# EAGLE schematic Downey (EAGLE 6.6.0)
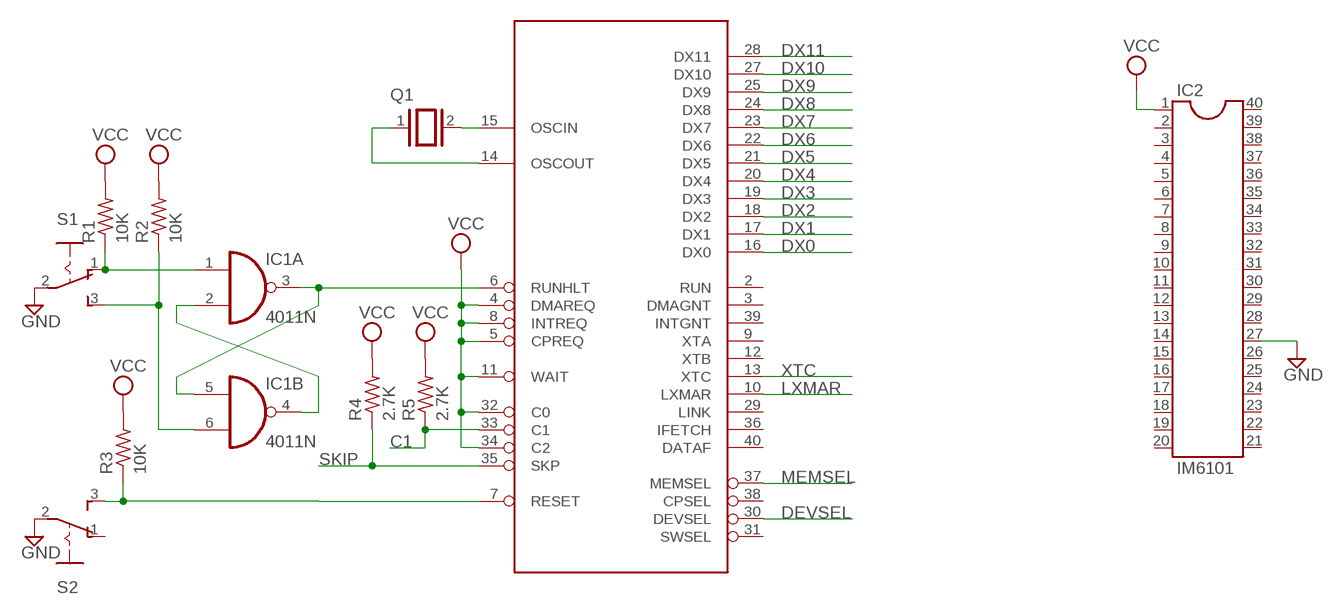
[diagram p0: schematic, sheet 1]

## Parts
IC1  4011N  [DIL14]
IC2  IM6101  DIL40  [DIL40]
Q1  XTAL/S  [QS]
R1  10K  R-US_0207/10  [0207/10]
R2  10K  R-US_0207/10  [0207/10]
R3  10K  R-US_0207/10  [0207/10]
R4  2.7K  R-US_0207/10  [0207/10]
R5  2.7K  R-US_0207/10  [0207/10]
S1  255SB  [255SB]
S2  255SB  [255SB]
U$1  IM6100  [DIL40]

## Nets
C1: R5.1 U$1.33(C1)
DEVSEL: U$1.30(DEVSEL)
DX0: U$1.16(DX0)
DX1: U$1.17(DX1)
DX2: U$1.18(DX2)
DX3: U$1.19(DX3)
DX4: U$1.20(DX4)
DX5: U$1.21(DX5)
DX6: U$1.22(DX6)
DX7: U$1.23(DX7)
DX8: U$1.24(DX8)
DX9: U$1.25(DX9)
DX10: U$1.27(DX10)
DX11: U$1.28(DX11)
GND: IC2.27 S1.2(P) S2.2(P)
LXMAR: U$1.10(LXMAR)
MEMSEL: U$1.37(MEMSEL)
N$1: Q1.1 U$1.14(OSCOUT)
N$2: R3.1 S2.3(S) U$1.7(RESET)
N$3: IC1.3(A:O) IC1.5(B:I0) U$1.6(RUNHLT)
N$4: IC1.2(A:I1) IC1.4(B:O)
N$5: Q1.2 U$1.15(OSCIN)
N$6: IC1.6(B:I1) R2.1 S1.3(S)
N$7: IC1.1(A:I0) R1.1 S1.1(O)
SKIP: R4.1 U$1.35(SKP)
VCC: IC2.1 R1.2 R2.2 R3.2 R4.2 R5.2 U$1.4(DMAREQ) U$1.5(CPREQ) U$1.8(INTREQ) U$1.11(WAIT) U$1.32(C0) U$1.34(C2)
XTC: U$1.13(XTC)
Unconnected: IC1.8(C:I0) IC1.9(C:I1) IC1.10(C:O) IC1.11(D:O) IC1.12(D:I0) IC1.13(D:I1) IC2.2 IC2.3 IC2.4 IC2.5 IC2.6 IC2.7 IC2.8 IC2.9 IC2.10 IC2.11 IC2.12 IC2.13 IC2.14 IC2.15 IC2.16 IC2.17 IC2.18 IC2.19 IC2.20 IC2.21 IC2.22 IC2.23 IC2.24 IC2.25 IC2.26 IC2.28 IC2.29 IC2.30 IC2.31 IC2.32 IC2.33 IC2.34 IC2.35 IC2.36 IC2.37 IC2.38 IC2.39 IC2.40 S2.1(O) U$1.2(RUN) U$1.3(DMAGNT) U$1.9(XTA) U$1.12(XTB) U$1.29(LINK) U$1.31(SWSEL) U$1.36(IFETCH) U$1.38(CPSEL) U$1.39(INTGNT) U$1.40(DATAF)

## Power pins joined to a net without a drawn wire
GND: U$1.26(GND)
VCC: U$1.1(VCC)
VDD: IC1.14(P:VDD)
VSS: IC1.7(P:VSS)

## Library data of the parts
IC1 = 40xx:4011: Quad 2-input NAND
IC2 = ic-package:DIL40: Dual In Line
Q1 = special:XTAL/S: CRYSTAL
R1-R5 = rcl:R-US_: RESISTOR, American symbol
S1 S2 = switch:255SB: SLIDING SWITCH Distributor Buerklin, 11G810
U$1 = dec-con:IM6100: IM6100 PDP-8 on a chip.